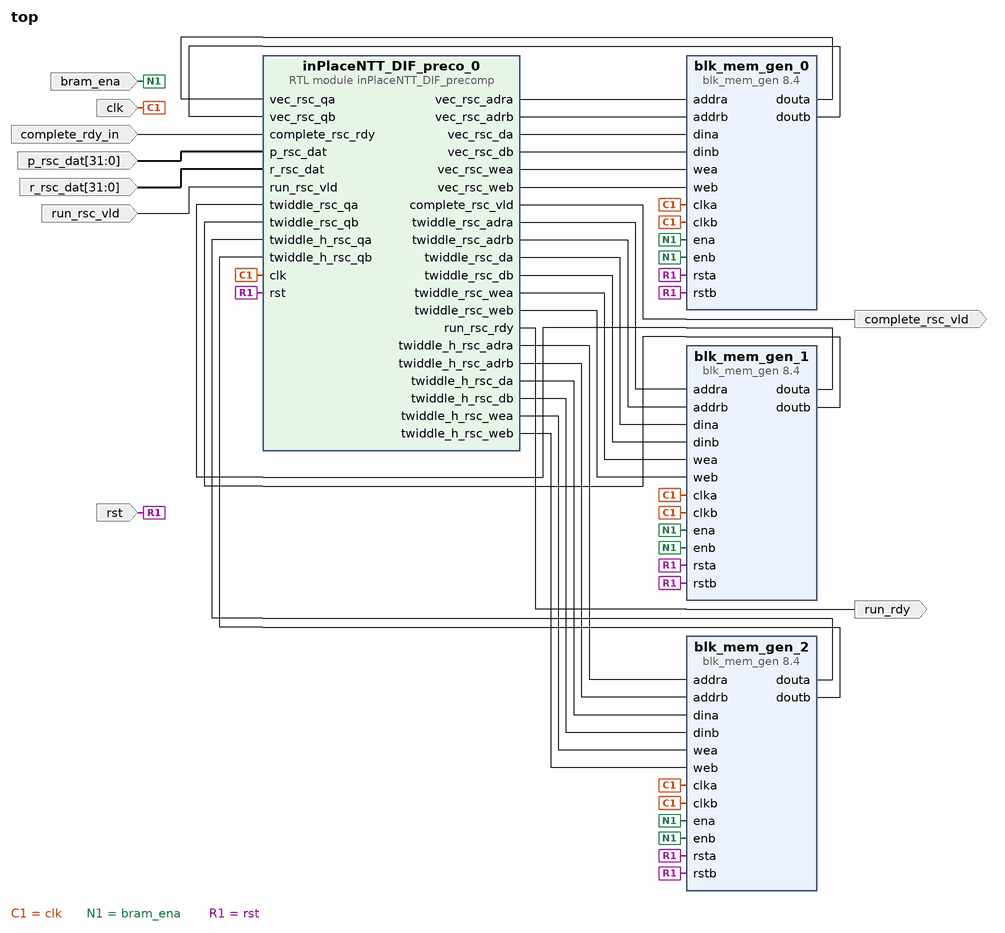
[diagram p0: block diagram of the top level]
# Vivado block design top, xc7vx690tffg1761-2, Vivado 2021.1
create_bd_design top

create_bd_port -dir I -from 31 -to 0 p_rsc_dat
create_bd_port -dir I -from 31 -to 0 r_rsc_dat
create_bd_port -dir I -type clk clk
set_property -dict {CONFIG.FREQ_HZ 100000000} [get_bd_ports clk]
create_bd_port -dir I rst
create_bd_port -dir I run_rsc_vld
create_bd_port -dir I bram_ena
create_bd_port -dir O run_rdy
create_bd_port -dir O complete_rsc_vld
create_bd_port -dir I complete_rdy_in

create_bd_cell -type module -reference inPlaceNTT_DIF_precomp inPlaceNTT_DIF_preco_0
create_bd_cell -type ip -vlnv xilinx.com:ip:blk_mem_gen:8.4 blk_mem_gen_0
set_property -dict [list \
  CONFIG.Enable_B Use_ENB_Pin \
  CONFIG.Memory_Type True_Dual_Port_RAM \
  CONFIG.Port_A_Write_Rate 50 \
  CONFIG.Port_B_Clock 100 \
  CONFIG.Port_B_Enable_Rate 100 \
  CONFIG.Port_B_Write_Rate 50 \
  CONFIG.Use_RSTB_Pin true \
] [get_bd_cells blk_mem_gen_0]
create_bd_cell -type ip -vlnv xilinx.com:ip:blk_mem_gen:8.4 blk_mem_gen_1
set_property -dict [list \
  CONFIG.Enable_B Use_ENB_Pin \
  CONFIG.Memory_Type True_Dual_Port_RAM \
  CONFIG.Port_A_Write_Rate 50 \
  CONFIG.Port_B_Clock 100 \
  CONFIG.Port_B_Enable_Rate 100 \
  CONFIG.Port_B_Write_Rate 50 \
  CONFIG.Use_RSTB_Pin true \
] [get_bd_cells blk_mem_gen_1]
create_bd_cell -type ip -vlnv xilinx.com:ip:blk_mem_gen:8.4 blk_mem_gen_2
set_property -dict [list \
  CONFIG.Enable_B Use_ENB_Pin \
  CONFIG.Memory_Type True_Dual_Port_RAM \
  CONFIG.Port_A_Write_Rate 50 \
  CONFIG.Port_B_Clock 100 \
  CONFIG.Port_B_Enable_Rate 100 \
  CONFIG.Port_B_Write_Rate 50 \
  CONFIG.Use_RSTB_Pin true \
] [get_bd_cells blk_mem_gen_2]

# ---- connections ----

connect_bd_net [get_bd_ports clk] \
  [get_bd_pins blk_mem_gen_0/clka] [get_bd_pins inPlaceNTT_DIF_preco_0/clk] [get_bd_pins blk_mem_gen_0/clkb] \
  [get_bd_pins blk_mem_gen_1/clka] [get_bd_pins blk_mem_gen_1/clkb] [get_bd_pins blk_mem_gen_2/clka] \
  [get_bd_pins blk_mem_gen_2/clkb]
connect_bd_net [get_bd_pins blk_mem_gen_0/douta] [get_bd_pins inPlaceNTT_DIF_preco_0/vec_rsc_qa]
connect_bd_net [get_bd_pins blk_mem_gen_0/doutb] [get_bd_pins inPlaceNTT_DIF_preco_0/vec_rsc_qb]
connect_bd_net [get_bd_pins blk_mem_gen_1/douta] [get_bd_pins inPlaceNTT_DIF_preco_0/twiddle_rsc_qa]
connect_bd_net [get_bd_pins blk_mem_gen_1/doutb] [get_bd_pins inPlaceNTT_DIF_preco_0/twiddle_rsc_qb]
connect_bd_net [get_bd_pins blk_mem_gen_2/douta] [get_bd_pins inPlaceNTT_DIF_preco_0/twiddle_h_rsc_qa]
connect_bd_net [get_bd_pins blk_mem_gen_2/doutb] [get_bd_pins inPlaceNTT_DIF_preco_0/twiddle_h_rsc_qb]
connect_bd_net [get_bd_ports bram_ena] \
  [get_bd_pins blk_mem_gen_0/ena] [get_bd_pins blk_mem_gen_0/enb] [get_bd_pins blk_mem_gen_1/ena] \
  [get_bd_pins blk_mem_gen_1/enb] [get_bd_pins blk_mem_gen_2/ena] [get_bd_pins blk_mem_gen_2/enb]
connect_bd_net [get_bd_ports complete_rdy_in] [get_bd_pins inPlaceNTT_DIF_preco_0/complete_rsc_rdy]
connect_bd_net [get_bd_pins inPlaceNTT_DIF_preco_0/complete_rsc_vld] [get_bd_ports complete_rsc_vld]
connect_bd_net [get_bd_pins inPlaceNTT_DIF_preco_0/run_rsc_rdy] [get_bd_ports run_rdy]
connect_bd_net [get_bd_pins inPlaceNTT_DIF_preco_0/twiddle_h_rsc_adra] [get_bd_pins blk_mem_gen_2/addra]
connect_bd_net [get_bd_pins inPlaceNTT_DIF_preco_0/twiddle_h_rsc_adrb] [get_bd_pins blk_mem_gen_2/addrb]
connect_bd_net [get_bd_pins inPlaceNTT_DIF_preco_0/twiddle_h_rsc_da] [get_bd_pins blk_mem_gen_2/dina]
connect_bd_net [get_bd_pins inPlaceNTT_DIF_preco_0/twiddle_h_rsc_db] [get_bd_pins blk_mem_gen_2/dinb]
connect_bd_net [get_bd_pins inPlaceNTT_DIF_preco_0/twiddle_h_rsc_wea] [get_bd_pins blk_mem_gen_2/wea]
connect_bd_net [get_bd_pins inPlaceNTT_DIF_preco_0/twiddle_h_rsc_web] [get_bd_pins blk_mem_gen_2/web]
connect_bd_net [get_bd_pins inPlaceNTT_DIF_preco_0/twiddle_rsc_adra] [get_bd_pins blk_mem_gen_1/addra]
connect_bd_net [get_bd_pins inPlaceNTT_DIF_preco_0/twiddle_rsc_adrb] [get_bd_pins blk_mem_gen_1/addrb]
connect_bd_net [get_bd_pins inPlaceNTT_DIF_preco_0/twiddle_rsc_da] [get_bd_pins blk_mem_gen_1/dina]
connect_bd_net [get_bd_pins inPlaceNTT_DIF_preco_0/twiddle_rsc_db] [get_bd_pins blk_mem_gen_1/dinb]
connect_bd_net [get_bd_pins inPlaceNTT_DIF_preco_0/twiddle_rsc_wea] [get_bd_pins blk_mem_gen_1/wea]
connect_bd_net [get_bd_pins inPlaceNTT_DIF_preco_0/twiddle_rsc_web] [get_bd_pins blk_mem_gen_1/web]
connect_bd_net [get_bd_pins inPlaceNTT_DIF_preco_0/vec_rsc_adra] [get_bd_pins blk_mem_gen_0/addra]
connect_bd_net [get_bd_pins inPlaceNTT_DIF_preco_0/vec_rsc_adrb] [get_bd_pins blk_mem_gen_0/addrb]
connect_bd_net [get_bd_pins inPlaceNTT_DIF_preco_0/vec_rsc_da] [get_bd_pins blk_mem_gen_0/dina]
connect_bd_net [get_bd_pins inPlaceNTT_DIF_preco_0/vec_rsc_db] [get_bd_pins blk_mem_gen_0/dinb]
connect_bd_net [get_bd_pins inPlaceNTT_DIF_preco_0/vec_rsc_wea] [get_bd_pins blk_mem_gen_0/wea]
connect_bd_net [get_bd_pins inPlaceNTT_DIF_preco_0/vec_rsc_web] [get_bd_pins blk_mem_gen_0/web]
connect_bd_net [get_bd_ports p_rsc_dat] [get_bd_pins inPlaceNTT_DIF_preco_0/p_rsc_dat]
connect_bd_net [get_bd_ports r_rsc_dat] [get_bd_pins inPlaceNTT_DIF_preco_0/r_rsc_dat]
connect_bd_net -net rst_0_1 [get_bd_ports rst] \
  [get_bd_pins inPlaceNTT_DIF_preco_0/rst] [get_bd_pins blk_mem_gen_0/rsta] [get_bd_pins blk_mem_gen_0/rstb] \
  [get_bd_pins blk_mem_gen_1/rsta] [get_bd_pins blk_mem_gen_1/rstb] [get_bd_pins blk_mem_gen_2/rsta] \
  [get_bd_pins blk_mem_gen_2/rstb]
connect_bd_net [get_bd_ports run_rsc_vld] [get_bd_pins inPlaceNTT_DIF_preco_0/run_rsc_vld]

validate_bd_design
save_bd_design
